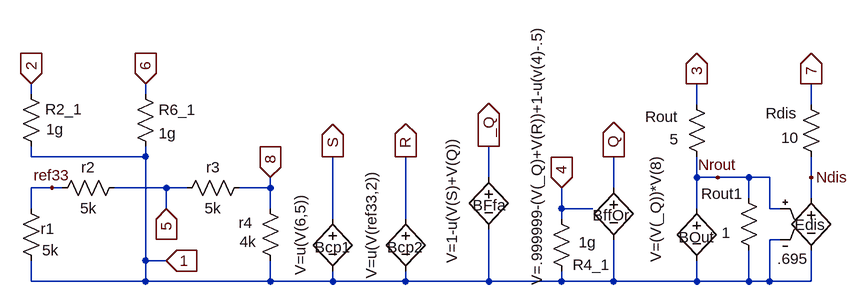
[diagram p0: schematic 0sw555.asc]
0sw555.asc, the LTspice schematic file:
Version 4
SHEET 1 1356 916
WIRE -576 336 -576 320
WIRE -576 432 -576 416
WIRE -576 512 -576 480
WIRE -576 624 -576 592
WIRE -544 480 -576 480
WIRE -528 480 -544 480
WIRE -400 336 -400 320
WIRE -400 432 -576 432
WIRE -400 432 -400 416
WIRE -400 592 -400 432
WIRE -400 624 -400 592
WIRE -400 624 -576 624
WIRE -368 480 -448 480
WIRE -368 512 -368 480
WIRE -368 592 -400 592
WIRE -336 480 -368 480
WIRE -208 480 -256 480
WIRE -208 480 -208 464
WIRE -208 512 -208 480
WIRE -208 624 -400 624
WIRE -208 624 -208 592
WIRE -112 528 -112 432
WIRE -112 624 -208 624
WIRE -112 624 -112 608
WIRE 0 528 0 432
WIRE 0 624 -112 624
WIRE 0 624 0 608
WIRE 128 464 128 416
WIRE 128 624 0 624
WIRE 128 624 128 544
WIRE 240 512 240 480
WIRE 240 528 240 512
WIRE 240 624 128 624
WIRE 240 624 240 608
WIRE 288 512 240 512
WIRE 320 480 320 432
WIRE 320 624 240 624
WIRE 320 624 320 560
WIRE 448 352 448 320
WIRE 448 464 448 432
WIRE 448 512 448 464
WIRE 448 624 320 624
WIRE 448 624 448 592
WIRE 480 464 448 464
WIRE 528 464 480 464
WIRE 528 496 528 464
WIRE 528 624 448 624
WIRE 528 624 528 576
WIRE 560 464 528 464
WIRE 560 512 560 464
WIRE 560 624 528 624
WIRE 560 624 560 560
WIRE 576 512 560 512
WIRE 576 560 560 560
WIRE 624 352 624 320
WIRE 624 464 624 432
WIRE 624 496 624 464
WIRE 624 624 560 624
WIRE 624 624 624 576
FLAG -544 480 ref33
FLAG -368 512 5
IOPIN -368 512 In
FLAG 624 320 7
IOPIN 624 320 Out
FLAG -208 464 8
IOPIN -208 464 In
FLAG 448 320 3
IOPIN 448 320 Out
FLAG -368 592 1
IOPIN -368 592 In
FLAG 240 480 4
IOPIN 240 480 In
FLAG -400 320 6
IOPIN -400 320 In
FLAG -112 432 S
IOPIN -112 432 Out
FLAG -576 320 2
IOPIN -576 320 In
FLAG 0 432 R
IOPIN 0 432 Out
FLAG 128 416 _Q
IOPIN 128 416 Out
FLAG 320 432 Q
IOPIN 320 432 Out
FLAG 480 464 Nrout
FLAG 624 464 Ndis
SYMBOL res -592 496 R0
WINDOW 0 31 47 Left 0
WINDOW 3 33 80 Left 0
SYMATTR InstName r1
SYMATTR Value 5k
SYMBOL res -432 464 R90
WINDOW 0 0 56 VBottom 0
WINDOW 3 32 56 VTop 0
SYMATTR InstName r2
SYMATTR Value 5k
SYMBOL res -352 496 R270
WINDOW 0 32 56 VTop 0
WINDOW 3 0 56 VBottom 0
SYMATTR InstName r3
SYMATTR Value 5k
SYMBOL res -224 496 R0
WINDOW 0 -33 38 Left 0
WINDOW 3 -31 67 Left 0
SYMATTR InstName r4
SYMATTR Value 4k
SYMBOL res -560 432 R180
WINDOW 0 -63 73 Left 0
WINDOW 3 -34 42 Left 0
SYMATTR InstName R2_1
SYMATTR Value 1g
SYMBOL bv -112 512 R0
WINDOW 0 -28 59 Left 0
WINDOW 3 -50 103 VLeft 0
SYMATTR InstName Bcp1
SYMATTR Value V=u(V(6,5))
SYMBOL bv 0 512 R0
WINDOW 0 -28 59 Left 0
WINDOW 3 -53 -60 VRight 0
SYMATTR InstName Bcp2
SYMATTR Value V=u(V(ref33,2))
SYMBOL bv 128 448 R0
WINDOW 0 -25 59 Left 0
WINDOW 3 -57 -47 VRight 0
SYMATTR InstName BFfa
SYMATTR Value V=1-u(V(S)+V(Q))
SYMBOL res -416 320 R0
SYMATTR InstName R6_1
SYMATTR Value 1g
SYMBOL bv 320 464 R0
WINDOW 0 -32 58 Left 0
WINDOW 3 -118 -241 VRight 0
SYMATTR InstName BffOr
SYMATTR Value V=.999999-(V(_Q)+V(R))+1-u(v(4)-.5)
SYMBOL bv 448 496 R0
WINDOW 0 -28 60 Left 0
WINDOW 3 -63 -67 VRight 0
SYMATTR InstName BOut
SYMATTR Value V=(V(_Q))*V(8)
SYMBOL res 432 336 R0
WINDOW 0 -63 35 Left 0
WINDOW 3 -26 69 Left 0
SYMATTR InstName Rout
SYMATTR Value 5
SYMBOL res 224 512 R0
WINDOW 0 33 86 Left 0
WINDOW 3 42 52 Left 0
SYMATTR InstName R4_1
SYMATTR Value 1g
SYMBOL res 608 336 R0
WINDOW 0 -54 29 Left 0
WINDOW 3 -30 67 Left 0
SYMATTR InstName Rdis
SYMATTR Value 10
SYMBOL res 512 480 R0
WINDOW 0 -57 9 Left 0
WINDOW 3 -26 69 Left 0
SYMATTR InstName Rout1
SYMATTR Value 1
SYMBOL e 624 480 R0
WINDOW 0 -25 57 Left 0
WINDOW 3 -52 109 Left 0
SYMATTR InstName Edis
SYMATTR Value .695

The netlist it stands for:
* 0sw555.asc
r1 ref33 1 5k
r2 5 ref33 5k
r3 5 8 5k
r4 8 1 4k
R2_1 1 2 1g
Bcp1 S 1 V=u(V(6,5))
Bcp2 R 1 V=u(V(ref33,2))
BFfa _Q 1 V=1-u(V(S)+V(Q))
R6_1 6 1 1g
BffOr Q 1 V=.999999-(V(_Q)+V(R))+1-u(v(4)-.5)
BOut Nrout 1 V=(V(_Q))*V(8)
Rout 3 Nrout 5
R4_1 4 1 1g
Rdis 7 Ndis 10
Rout1 Nrout 1 1
Edis Ndis 1 Nrout 1 .695
.backanno
.end